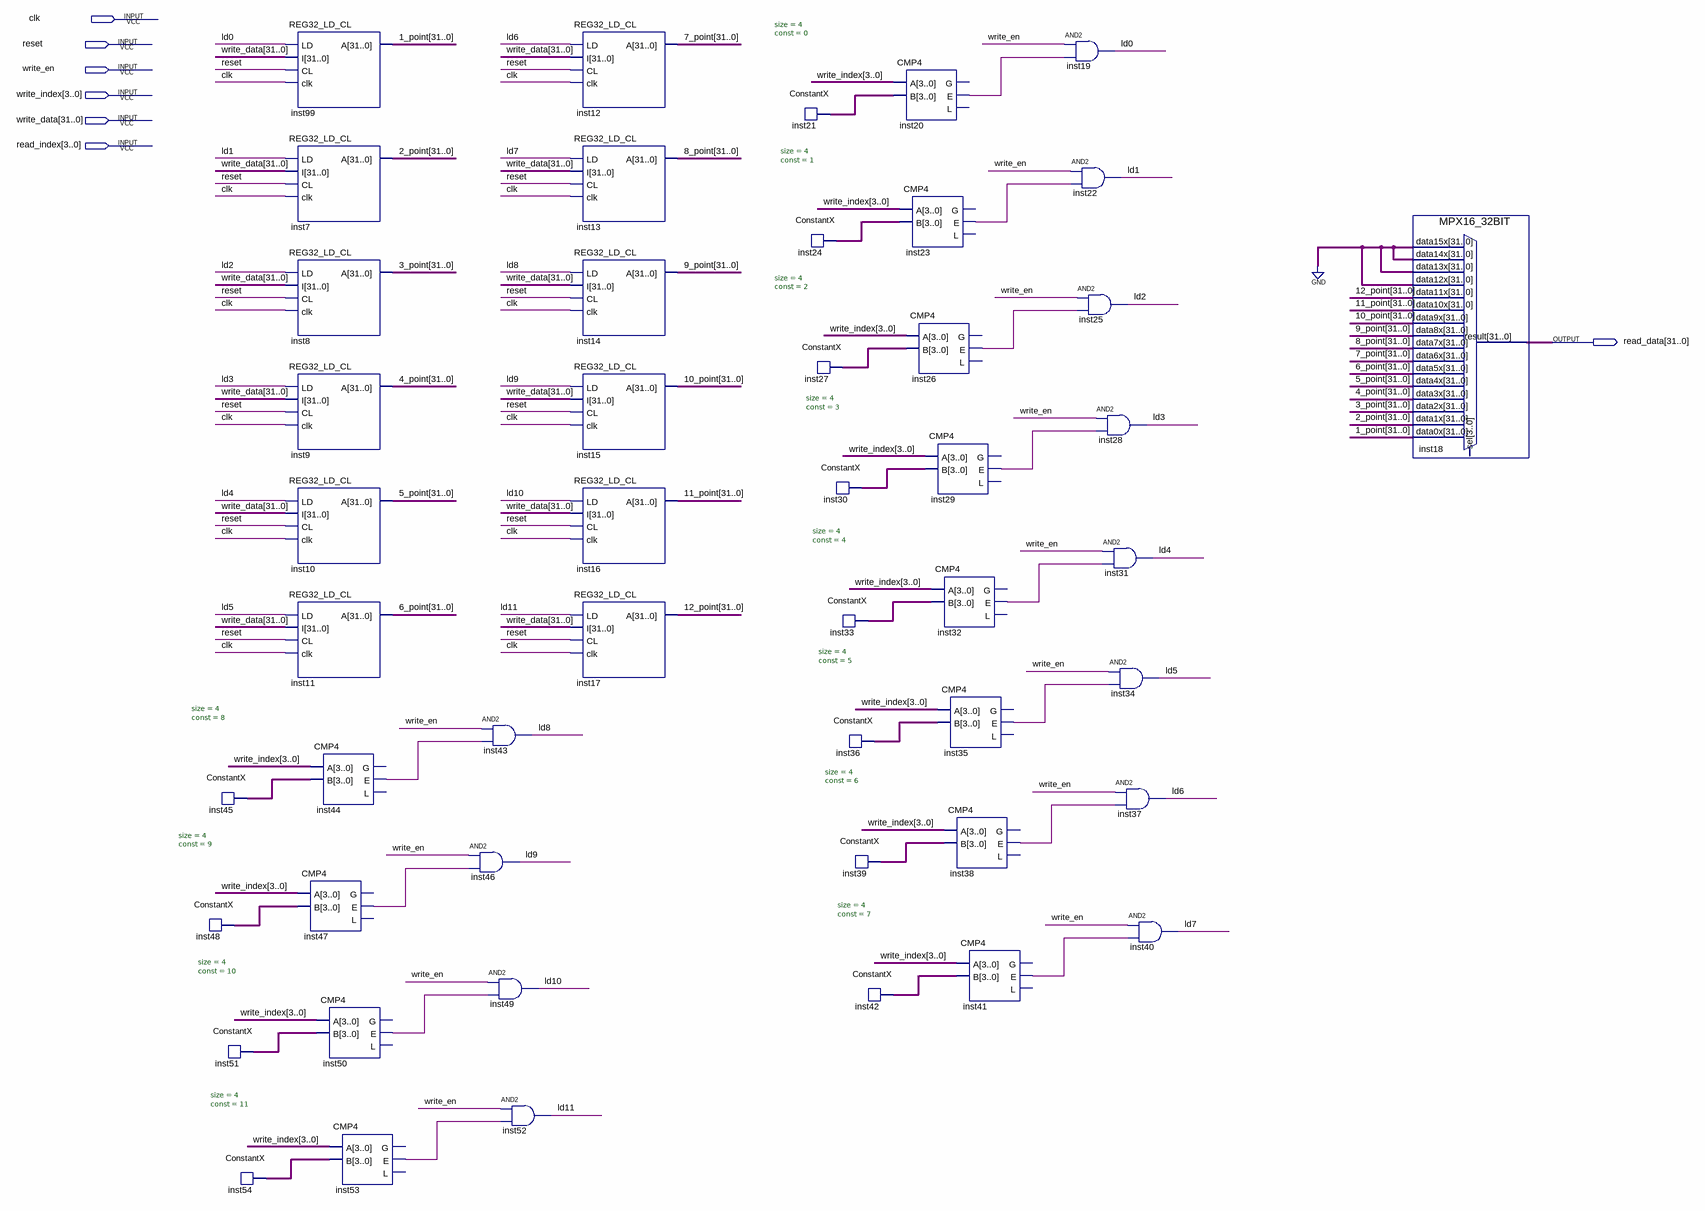
[diagram p0: schematic sheet]
// Quartus schematic PointBank12.bdf as structural Verilog: 49 symbols, 7 pins
module PointBank12 (
  input  clk,
  input  reset,
  input  write_en,
  input  [3:0] write_index,
  input  [31:0] write_data,
  input  [3:0] read_index,
  output [31:0] read_data
);

  wire inst20_e, inst23_e, inst26_e, inst29_e, inst32_e, inst35_e, inst38_e, inst41_e, inst44_e, inst47_e,
       inst50_e, inst53_e, ld0, ld1, ld2, ld3, ld4, ld5, ld6, ld7, ld8, ld9, ld10, ld11;
  wire [3:0] inst21_data_out, inst24_data_out, inst27_data_out, inst30_data_out, inst33_data_out,
       inst36_data_out, inst39_data_out, inst42_data_out, inst45_data_out, inst48_data_out, inst51_data_out,
       inst54_data_out;
  wire [31:0] \1_point , \2_point , \3_point , \4_point , \5_point , \6_point , \7_point , \8_point ,
       \9_point , \10_point , \11_point , \12_point ;

  ConstantX #(.size(4), .\const (8)) inst45 (.DATA_OUT(inst45_data_out));
  ConstantX #(.size(4), .\const (9)) inst48 (.DATA_OUT(inst48_data_out));
  ConstantX #(.size(4), .\const (10)) inst51 (.DATA_OUT(inst51_data_out));
  ConstantX #(.size(4), .\const (11)) inst54 (.DATA_OUT(inst54_data_out));
  REG32_LD_CL inst99 (.LD(ld0), .I(write_data), .CL(reset), .clk(clk), .A(\1_point ));
  REG32_LD_CL inst7 (.LD(ld1), .I(write_data), .CL(reset), .clk(clk), .A(\2_point ));
  REG32_LD_CL inst8 (.LD(ld2), .I(write_data), .CL(reset), .clk(clk), .A(\3_point ));
  REG32_LD_CL inst9 (.LD(ld3), .I(write_data), .CL(reset), .clk(clk), .A(\4_point ));
  REG32_LD_CL inst10 (.LD(ld4), .I(write_data), .CL(reset), .clk(clk), .A(\5_point ));
  REG32_LD_CL inst11 (.LD(ld5), .I(write_data), .CL(reset), .clk(clk), .A(\6_point ));
  CMP4 inst44 (.A(write_index), .B(inst45_data_out), .E(inst44_e));  // open: G, L
  CMP4 inst47 (.A(write_index), .B(inst48_data_out), .E(inst47_e));  // open: G, L
  CMP4 inst50 (.A(write_index), .B(inst51_data_out), .E(inst50_e));  // open: G, L
  CMP4 inst53 (.A(write_index), .B(inst54_data_out), .E(inst53_e));  // open: G, L
  and inst46 (ld9, write_en, inst47_e);
  and inst43 (ld8, write_en, inst44_e);
  and inst49 (ld10, write_en, inst50_e);
  and inst52 (ld11, write_en, inst53_e);
  REG32_LD_CL inst12 (.LD(ld6), .I(write_data), .CL(reset), .clk(clk), .A(\7_point ));
  REG32_LD_CL inst13 (.LD(ld7), .I(write_data), .CL(reset), .clk(clk), .A(\8_point ));
  REG32_LD_CL inst14 (.LD(ld8), .I(write_data), .CL(reset), .clk(clk), .A(\9_point ));
  REG32_LD_CL inst15 (.LD(ld9), .I(write_data), .CL(reset), .clk(clk), .A(\10_point ));
  REG32_LD_CL inst16 (.LD(ld10), .I(write_data), .CL(reset), .clk(clk), .A(\11_point ));
  REG32_LD_CL inst17 (.LD(ld11), .I(write_data), .CL(reset), .clk(clk), .A(\12_point ));
  ConstantX #(.size(4), .\const (0)) inst21 (.DATA_OUT(inst21_data_out));
  ConstantX #(.size(4), .\const (1)) inst24 (.DATA_OUT(inst24_data_out));
  ConstantX #(.size(4), .\const (2)) inst27 (.DATA_OUT(inst27_data_out));
  ConstantX #(.size(4), .\const (3)) inst30 (.DATA_OUT(inst30_data_out));
  ConstantX #(.size(4), .\const (4)) inst33 (.DATA_OUT(inst33_data_out));
  ConstantX #(.size(4), .\const (5)) inst36 (.DATA_OUT(inst36_data_out));
  ConstantX #(.size(4), .\const (6)) inst39 (.DATA_OUT(inst39_data_out));
  ConstantX #(.size(4), .\const (7)) inst42 (.DATA_OUT(inst42_data_out));
  CMP4 inst20 (.A(write_index), .B(inst21_data_out), .E(inst20_e));  // open: G, L
  CMP4 inst23 (.A(write_index), .B(inst24_data_out), .E(inst23_e));  // open: G, L
  CMP4 inst26 (.A(write_index), .B(inst27_data_out), .E(inst26_e));  // open: G, L
  CMP4 inst29 (.A(write_index), .B(inst30_data_out), .E(inst29_e));  // open: G, L
  CMP4 inst32 (.A(write_index), .B(inst33_data_out), .E(inst32_e));  // open: G, L
  CMP4 inst35 (.A(write_index), .B(inst36_data_out), .E(inst35_e));  // open: G, L
  CMP4 inst38 (.A(write_index), .B(inst39_data_out), .E(inst38_e));  // open: G, L
  CMP4 inst41 (.A(write_index), .B(inst42_data_out), .E(inst41_e));  // open: G, L
  and inst19 (ld0, write_en, inst20_e);
  and inst22 (ld1, write_en, inst23_e);
  and inst25 (ld2, write_en, inst26_e);
  and inst28 (ld3, write_en, inst29_e);
  and inst31 (ld4, write_en, inst32_e);
  and inst34 (ld5, write_en, inst35_e);
  and inst37 (ld6, write_en, inst38_e);
  and inst40 (ld7, write_en, inst41_e);
  MPX16_32BIT inst18 (
    .data15x({32{1'b0}}), .data14x({32{1'b0}}), .data13x({32{1'b0}}), .data12x({32{1'b0}}),
    .data11x(\12_point ), .data10x(\11_point ), .data9x(\10_point ), .data8x(\9_point ), .data7x(\8_point ),
    .data6x(\7_point ), .data5x(\6_point ), .data4x(\5_point ), .data3x(\4_point ), .data2x(\3_point ),
    .data1x(\2_point ), .data0x(\1_point ), .result(read_data));  // open: sel
endmodule
